# EAGLE design dnc (EAGLE 7.1.0)
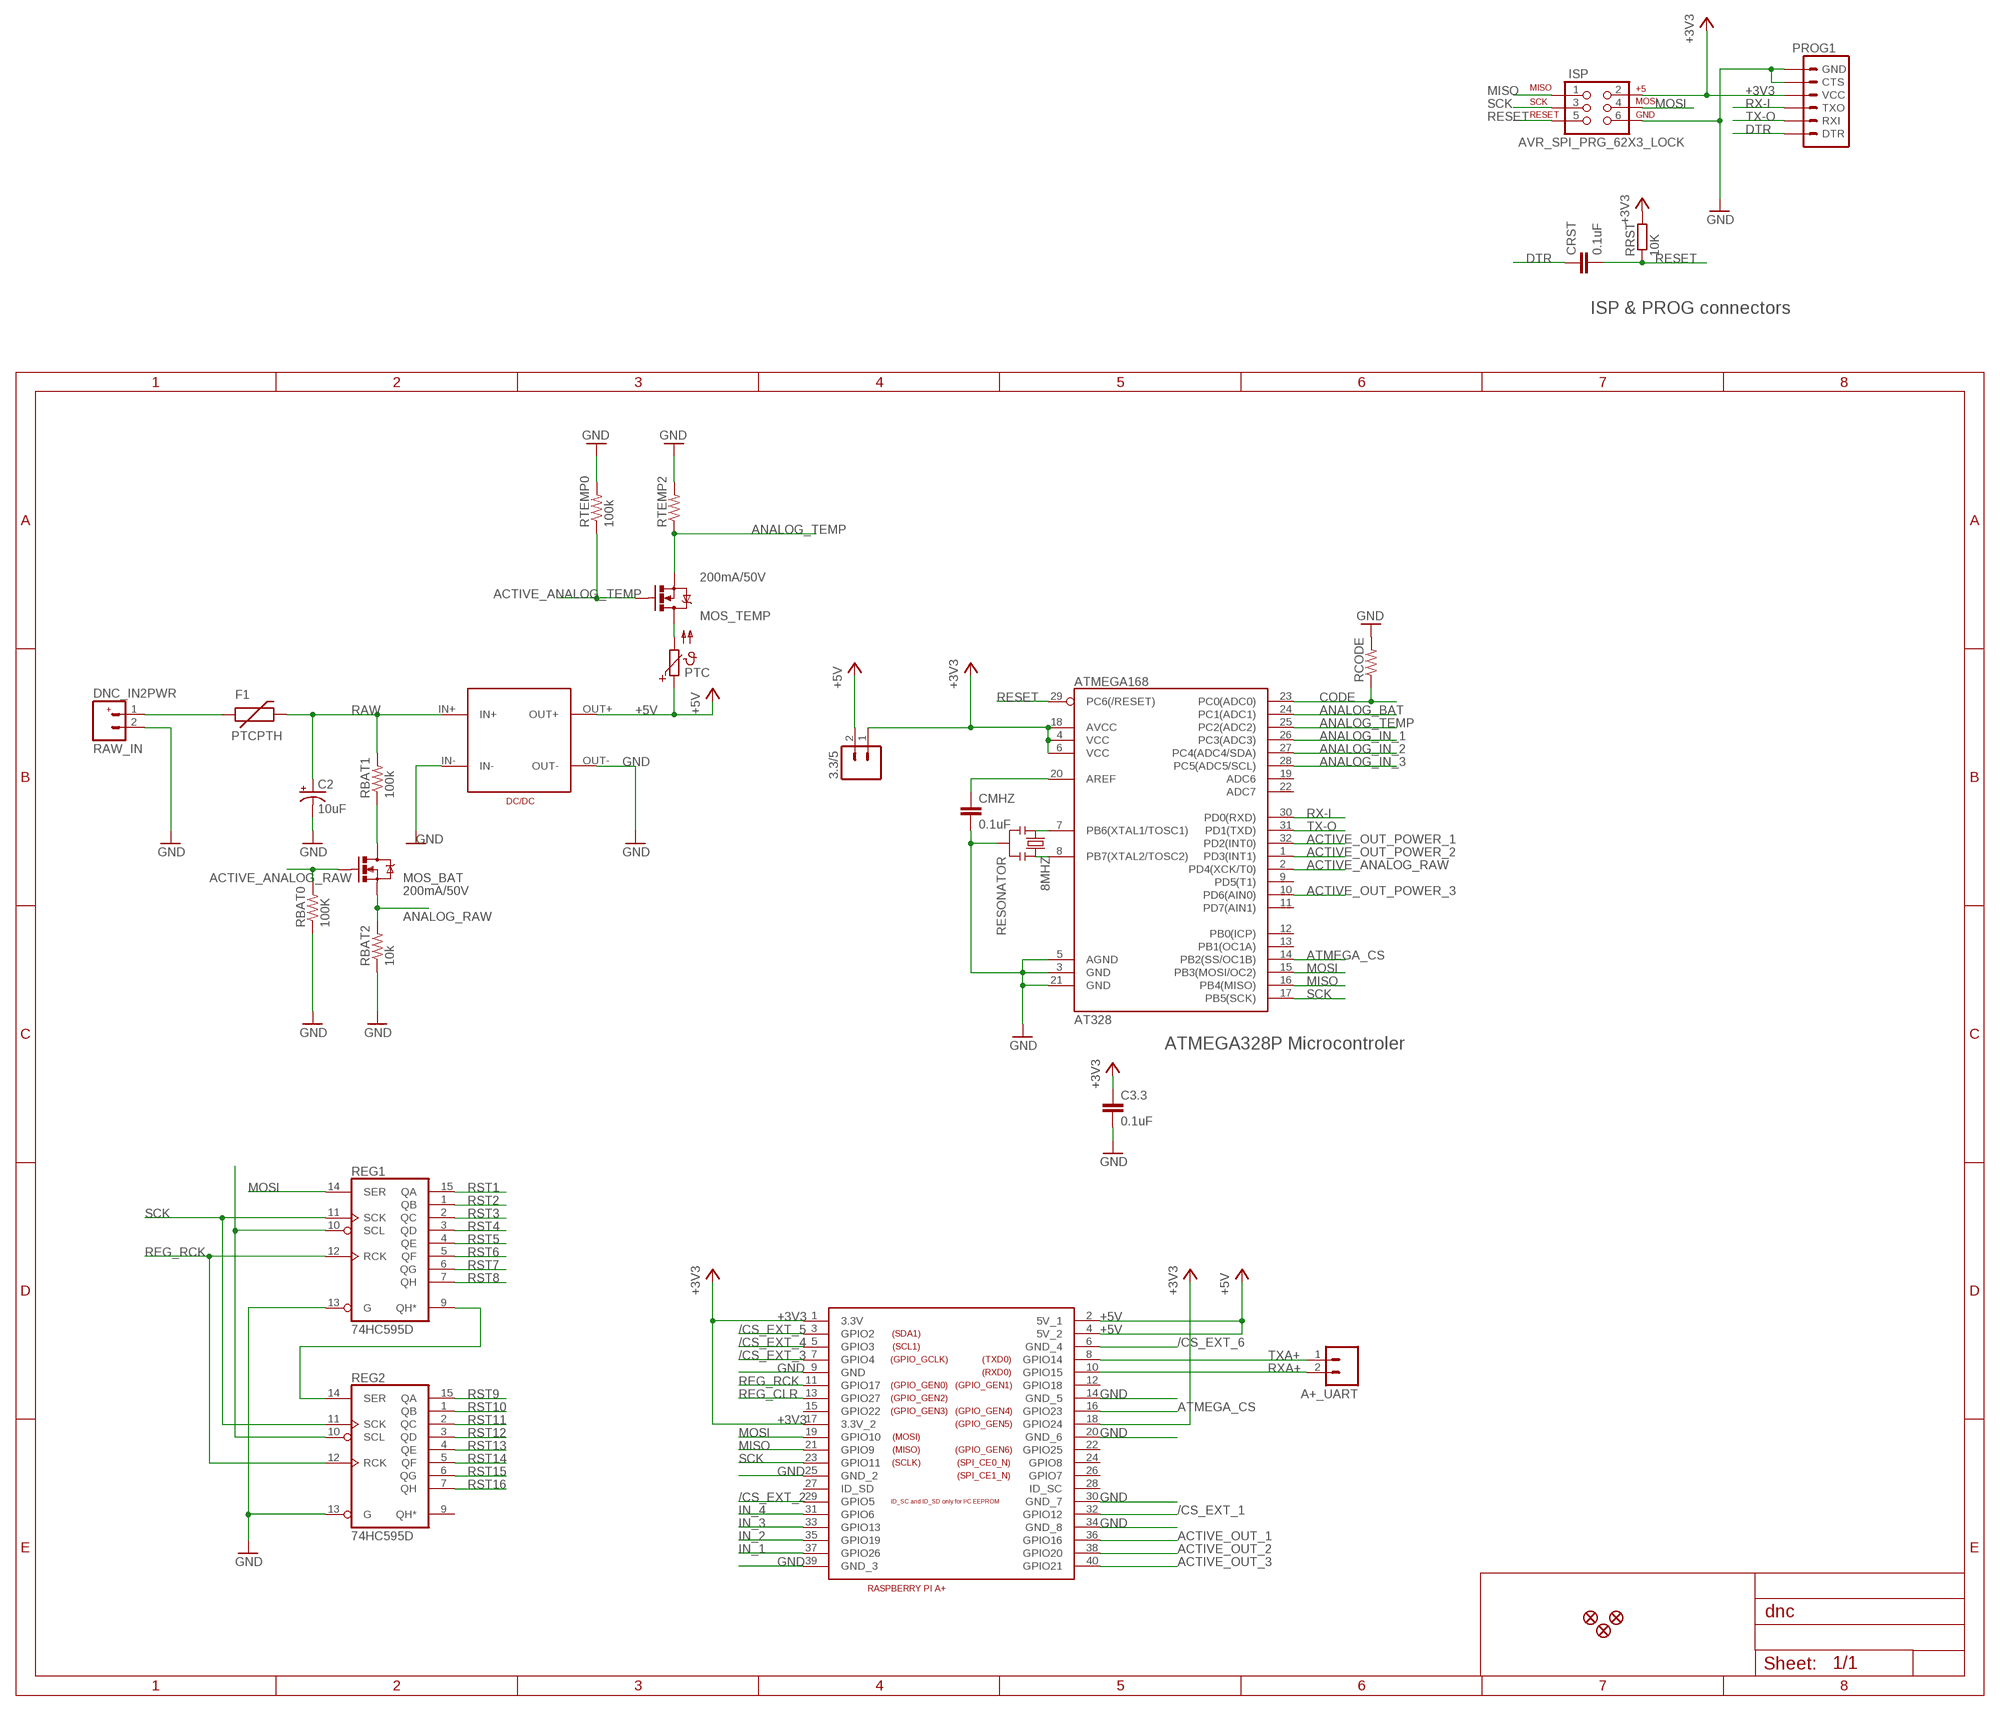
[diagram p0: schematic, sheet 1, part 1 of 2]
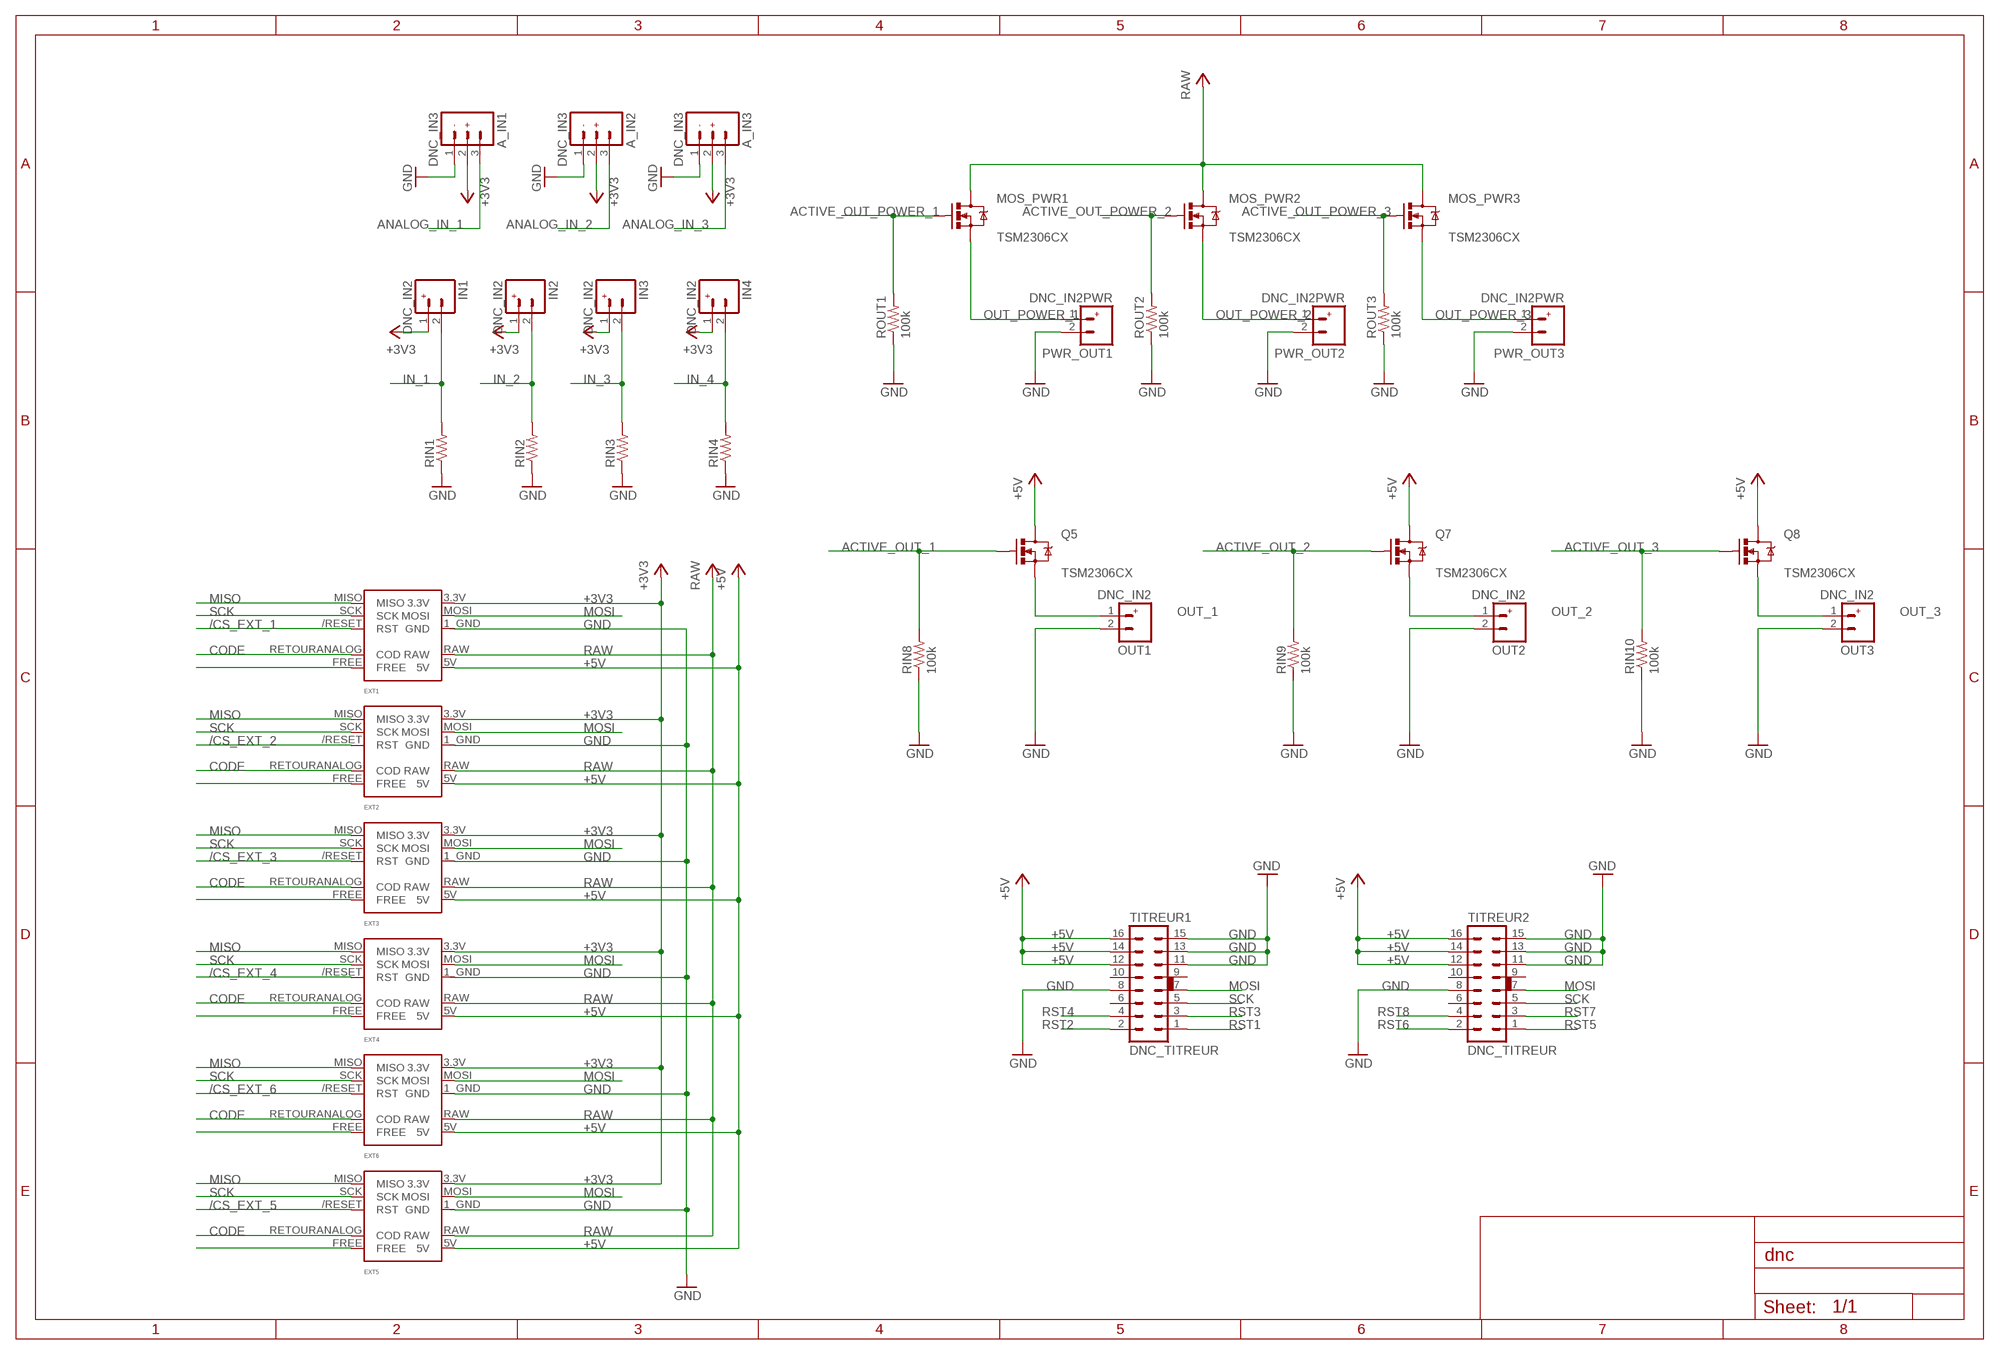
[diagram p1: schematic, sheet 1, part 2 of 2]

## Parts
3.3/5  M02PTH3  [1X02_LONGPADS]
8MHZ  RESONATOR  [RESONATOR_7MM]
A+_UART  M02LOCK_LONGPADS  [1X02_LOCK_LONGPADS]
A_IN1  DNC_IN3  [DNC_IN3]
A_IN2  DNC_IN3  [DNC_IN3]
A_IN3  DNC_IN3  [DNC_IN3]
AT328  ATMEGA168  [TQFP32-08]
C2  10uF  CAP_POL1206  [EIA3216]
C3.3  0.1uF  C-EUC0805  [C0805]
CMHZ  0.1uF  C-EUC0805  [C0805]
CRST  0.1uF  C-EUC0805  [C0805]
EXT1  EXT-DNC  [EXTPINDNC]
EXT2  EXT-DNC  [EXTPINDNC]
EXT3  EXT-DNC  [EXTPINDNC]
EXT4  EXT-DNC  [EXTPINDNC]
EXT5  EXT-DNC  [EXTPINDNC]
EXT6  EXT-DNC  [EXTPINDNC]
F1  PTCPTH  [PTC]
IN1  DNC_IN2  [DNC_IN2]
IN2  DNC_IN2  [DNC_IN2]
IN3  DNC_IN2  [DNC_IN2]
IN4  DNC_IN2  [DNC_IN2]
ISP  AVR_SPI_PRG_62X3_LOCK  [2X3_LOCK]
JP13  FIDUCIAL1X2.5  [FIDUCIAL-1X2.5]
JP14  FIDUCIAL1X2.5  [FIDUCIAL-1X2.5]
JP19  FIDUCIAL1X2.5  [FIDUCIAL-1X2.5]
MOS_BAT  200mA/50V  MOSFET-NCHANNELBSS138  [SOT23-3]
MOS_PWR1  TSM2306CX  MOSFET-NCHANNEL2N7002PW  [SOT323]
MOS_PWR2  TSM2306CX  MOSFET-NCHANNEL2N7002PW  [SOT323]
MOS_PWR3  TSM2306CX  MOSFET-NCHANNEL2N7002PW  [SOT323]
MOS_TEMP  200mA/50V  MOSFET-NCHANNELBSS138  [SOT23-3]
OUT1  DNC_IN2  [DNC_IN2]
OUT2  DNC_IN2  [DNC_IN2]
OUT3  DNC_IN2  [DNC_IN2]
PROG1  ARDUINO_SERIAL_PROGRAMLOCK  [1X06_LOCK]
PTC  PTC679  [P679]
PWR_OUT1  DNC_IN2PWR  [DNC_IN2_PWR]
PWR_OUT2  DNC_IN2PWR  [DNC_IN2_PWR]
PWR_OUT3  DNC_IN2PWR  [DNC_IN2_PWR]
Q5  TSM2306CX  MOSFET-NCHANNEL2N7002PW  [SOT323]
Q7  TSM2306CX  MOSFET-NCHANNEL2N7002PW  [SOT323]
Q8  TSM2306CX  MOSFET-NCHANNEL2N7002PW  [SOT323]
RAW_IN  DNC_IN2PWR  [DNC_IN2_PWR]
RBAT0  100K  RESISTOR0603-RES  [0603-RES]
RBAT1  100k  RESISTOR0603-RES  [0603-RES]
RBAT2  10k  RESISTOR0603-RES  [0603-RES]
RCODE  RESISTOR0603-RES  [0603-RES]
REG1  74HC595D  [SO16]
REG2  74HC595D  [SO16]
RIN1  RESISTOR0603-RES  [0603-RES]
RIN2  RESISTOR0603-RES  [0603-RES]
RIN3  RESISTOR0603-RES  [0603-RES]
RIN4  RESISTOR0603-RES  [0603-RES]
RIN8  100k  RESISTOR0603-RES  [0603-RES]
RIN9  100k  RESISTOR0603-RES  [0603-RES]
RIN10  100k  RESISTOR0603-RES  [0603-RES]
ROUT1  100k  RESISTOR0603-RES  [0603-RES]
ROUT2  100k  RESISTOR0603-RES  [0603-RES]
ROUT3  100k  RESISTOR0603-RES  [0603-RES]
RRST  10K  R-EU_R0603  [R0603]
RTEMP0  100k  RESISTOR0603-RES  [0603-RES]
RTEMP2  RESISTOR0603-RES  [0603-RES]
TITREUR1  DNC_TITREUR  [DNC_TITREUR]
TITREUR2  DNC_TITREUR  [DNC_TITREUR]
U$4  RASPIA+  [RASPIA+]
U$5  DC/DC_SEED  [DC/DC_SEED]

## Nets
+3V3: 3.3/5.1 A_IN1.2 A_IN2.2 A_IN3.2 AT328.4(VCC) AT328.6(VCC) AT328.18(AVCC) C3.3.1 EXT1.3.3V EXT2.3.3V EXT3.3.3V EXT4.3.3V EXT5.3.3V EXT6.3.3V IN1.1 IN2.1 IN3.1 IN4.1 ISP.2 PROG1.4(VCC) RRST.2 U$4.1(3.3V) U$4.17(3.3V_2) U$4.18(GPIO24)
+5V: 3.3/5.2 EXT1.5V EXT2.5V EXT3.5V EXT4.5V EXT5.5V EXT6.5V PTC.1 Q5.3(D) Q7.3(D) Q8.3(D) TITREUR1.12 TITREUR1.14 TITREUR1.16 TITREUR2.12 TITREUR2.14 TITREUR2.16 U$4.2(5V_1) U$4.4(5V_2) U$5.OUT+
/CS_EXT_1: EXT1./RESET(RST) U$4.32(GPIO12)
/CS_EXT_2: EXT2./RESET(RST) U$4.29(GPIO5)
/CS_EXT_3: EXT3./RESET(RST) U$4.7(GPIO4)
/CS_EXT_4: EXT4./RESET(RST) U$4.5(GPIO3)
/CS_EXT_5: EXT5./RESET(RST) U$4.3(GPIO2)
/CS_EXT_6: EXT6./RESET(RST) U$4.6(GND_4)
ACTIVE_ANALOG_RAW: AT328.2(PD4(XCK/T0)) MOS_BAT.1(G) RBAT0.2
ACTIVE_ANALOG_TEMP: MOS_TEMP.1(G) RTEMP0.1
ACTIVE_OUT_1: Q5.1(G) RIN8.2 U$4.36(GPIO16)
ACTIVE_OUT_2: Q7.1(G) RIN9.2 U$4.38(GPIO20)
ACTIVE_OUT_3: Q8.1(G) RIN10.2 U$4.40(GPIO21)
ACTIVE_OUT_POWER_1: AT328.32(PD2(INT0)) MOS_PWR1.1(G) ROUT1.2
ACTIVE_OUT_POWER_2: AT328.1(PD3(INT1)) MOS_PWR2.1(G) ROUT2.2
ACTIVE_OUT_POWER_3: AT328.10(PD6(AIN0)) MOS_PWR3.1(G) ROUT3.2
ANALOG_BAT: AT328.24(PC1(ADC1))
ANALOG_IN_1: A_IN1.3 AT328.26(PC3(ADC3))
ANALOG_IN_2: A_IN2.3 AT328.27(PC4(ADC4/SDA))
ANALOG_IN_3: A_IN3.3 AT328.28(PC5(ADC5/SCL))
ANALOG_RAW: MOS_BAT.2(S) RBAT2.2
ANALOG_TEMP: AT328.25(PC2(ADC2)) MOS_TEMP.2(S) RTEMP2.1
AREF: AT328.20(AREF) CMHZ.1
ATMEGA_CS: AT328.14(PB2(SS/OC1B)) U$4.16(GPIO23)
CODE: AT328.23(PC0(ADC0)) EXT1.RETOURANALOG(COD) EXT2.RETOURANALOG(COD) EXT3.RETOURANALOG(COD) EXT4.RETOURANALOG(COD) EXT5.RETOURANALOG(COD) EXT6.RETOURANALOG(COD) RCODE.1
DTR: CRST.1 PROG1.1(DTR)
GND: 8MHZ.2 A_IN1.1 A_IN2.1 A_IN3.1 AT328.3(GND) AT328.5(AGND) AT328.21(GND) C2.C(-) C3.3.2 CMHZ.2 EXT1.1_GND(GND) EXT2.1_GND(GND) EXT3.1_GND(GND) EXT4.1_GND(GND) EXT5.1_GND(GND) EXT6.1_GND(GND) ISP.6 OUT1.2 OUT2.2 OUT3.2 PROG1.5(CTS) PROG1.6(GND) PWR_OUT1.2 PWR_OUT2.2 PWR_OUT3.2 RAW_IN.2 RBAT0.1 RBAT2.1 RCODE.2 REG1.13(G) REG2.13(G) RIN1.1 RIN2.1 RIN3.1 RIN4.1 RIN8.1 RIN9.1 RIN10.1 ROUT1.1 ROUT2.1 ROUT3.1 RTEMP0.2 RTEMP2.2 TITREUR1.8 TITREUR1.11 TITREUR1.13 TITREUR1.15 TITREUR2.8 TITREUR2.11 TITREUR2.13 TITREUR2.15 U$4.9(GND) U$4.14(GND_5) U$4.20(GND_6) U$4.25(GND_2) U$4.30(GND_7) U$4.34(GND_8) U$4.39(GND_3) U$5.IN- U$5.OUT-
IN_1: IN1.2 RIN1.2 U$4.37(GPIO26)
IN_2: IN2.2 RIN2.2 U$4.35(GPIO19)
IN_3: IN3.2 RIN3.2 U$4.33(GPIO13)
IN_4: IN4.2 RIN4.2 U$4.31(GPIO6)
MISO: AT328.16(PB4(MISO)) EXT1.MISO EXT2.MISO EXT3.MISO EXT4.MISO EXT5.MISO EXT6.MISO ISP.1 U$4.21(GPIO9)
MOSI: AT328.15(PB3(MOSI/OC2)) EXT1.MOSI EXT2.MOSI EXT3.MOSI EXT4.MOSI EXT5.MOSI EXT6.MOSI ISP.4 REG1.14(SER) TITREUR1.7 TITREUR2.7 U$4.19(GPIO10)
N$3: MOS_BAT.3(D) RBAT1.1
N$4: EXT2.FREE
N$5: EXT3.FREE
N$7: REG1.9(QH*) REG2.14(SER)
N$8: EXT4.FREE
N$9: EXT6.FREE
N$10: EXT5.FREE
N$11: MOS_TEMP.3(D) PTC.2
N$12: F1.P$1 RAW_IN.1
N$21: EXT1.FREE
N$43: 8MHZ.1 AT328.7(PB6(XTAL1/TOSC1))
N$44: 8MHZ.3 AT328.8(PB7(XTAL2/TOSC2))
OUT_1: OUT1.1 Q5.2(S)
OUT_2: OUT2.1 Q7.2(S)
OUT_3: OUT3.1 Q8.2(S)
OUT_POWER_1: MOS_PWR1.2(S) PWR_OUT1.1
OUT_POWER_2: MOS_PWR2.2(S) PWR_OUT2.1
OUT_POWER_3: MOS_PWR3.2(S) PWR_OUT3.1
RAW: C2.A(+) EXT1.RAW EXT2.RAW EXT3.RAW EXT4.RAW EXT5.RAW EXT6.RAW F1.P$2 MOS_PWR1.3(D) MOS_PWR2.3(D) MOS_PWR3.3(D) RBAT1.2 U$5.IN+
REG_CLR: REG1.10(SCL) REG2.10(SCL) U$4.13(GPIO27)
REG_RCK: REG1.12(RCK) REG2.12(RCK) U$4.11(GPIO17)
RESET: AT328.29(PC6(/RESET)) CRST.2 ISP.5 RRST.1
RST1: REG1.15(QA) TITREUR1.1
RST2: REG1.1(QB) TITREUR1.2
RST3: REG1.2(QC) TITREUR1.3
RST4: REG1.3(QD) TITREUR1.4
RST5: REG1.4(QE) TITREUR2.1
RST6: REG1.5(QF) TITREUR2.2
RST7: REG1.6(QG) TITREUR2.3
RST8: REG1.7(QH) TITREUR2.4
RST9: REG2.15(QA)
RST10: REG2.1(QB)
RST11: REG2.2(QC)
RST12: REG2.3(QD)
RST13: REG2.4(QE)
RST14: REG2.5(QF)
RST15: REG2.6(QG)
RST16: REG2.7(QH)
RX-I: AT328.30(PD0(RXD)) PROG1.3(TXO)
RXA+: A+_UART.2 U$4.10(GPIO15)
SCK: AT328.17(PB5(SCK)) EXT1.SCK EXT2.SCK EXT3.SCK EXT4.SCK EXT5.SCK EXT6.SCK ISP.3 REG1.11(SCK) REG2.11(SCK) TITREUR1.5 TITREUR2.5 U$4.23(GPIO11)
TX-O: AT328.31(PD1(TXD)) PROG1.2(RXI)
TXA+: A+_UART.1 U$4.8(GPIO14)
Unconnected: AT328.9(PD5(T1)) AT328.11(PD7(AIN1)) AT328.12(PB0(ICP)) AT328.13(PB1(OC1A)) AT328.19(ADC6) AT328.22(ADC7) REG2.9(QH*) TITREUR1.6 TITREUR1.9 TITREUR1.10 TITREUR2.6 TITREUR2.9 TITREUR2.10 U$4.12(GPIO18) U$4.15(GPIO22) U$4.22(GPIO25) U$4.24(GPIO8) U$4.26(GPIO7) U$4.27(ID_SD) U$4.28(ID_SC)

## Notes on the sheet
- ISP & PROG connectors
- ATMEGA328P Microcontroler

## Power pins joined to a net without a drawn wire
GND: REG1.8(GND) REG2.8(GND)
VCC: REG1.16(VCC) REG2.16(VCC)

## Library data of the parts
3.3/5 A+_UART = SparkFun:M02: Header 2 Standard 2-pin 0.1" header. Use with straight break away headers (SKU : PRT-00116), right angle break away headers (PRT-00553), swiss pins (PRT-00743), machine pins (PRT-00117), and female headers (PRT-00115). Molex polarized connector foot print use with SKU : PRT-08233 with associated crimp pins and housings.
8MHZ = pierre_vv:RESONATOR
A_IN1-A_IN3 = pierre_vv:DNC_IN3
AT328 = SparkFun:ATMEGA168
C2 = SparkFun:CAP_POL: Capacitor Polarized These are standard SMD and PTH capacitors. Normally 10uF, 47uF, and 100uF in electrolytic and tantalum varieties. Always verify the external diameter of the through hole cap, it varies with capacity, voltage, and manufacturer. The EIA devices should be standard.
C3.3 CMHZ CRST = rcl:C-EU: CAPACITOR, European symbol
EXT1-EXT6 = pierre_vv:EXT-DNC
F1 = SparkFun-PowerIC:PTC: Resettable Fuse PTC Resettable Fuse. Spark Fun Electronics SKU : COM-08357
IN1-IN4 OUT1-OUT3 PWR_OUT1-PWR_OUT3 RAW_IN = pierre_vv:DNC_IN2
ISP = SparkFun:AVR_SPI_PRG_6: AVR ISP 6 Pin This is the reduced ISP connector for AVR programming. Common on Arduino. This footprint will take up less PCB space and can be used with a 10-pin to 6-pin adapter such as SKU: BOB-08508
JP13 JP14 JP19 = SparkFun:FIDUCIAL: Fiducial Alignment Points Various fiducial points for machine vision alignment.
MOS_BAT MOS_TEMP = SparkFun-DiscreteSemi:MOSFET-NCHANNEL: Common NMOSFET Parts MFG P/N Store ID Prod ID FDD8780 TRANS-09984 SI7820DN TRANS-11055 FDS6630A IC-08089 2N7002PW TRANS-11151 FQP30N06L COM-10213 TRANS-10060 BSS123LT1G TRANS-08345 BSS138 TRANS-00830 BS170 2N7000; PROD_ID: TRANS-00830
MOS_PWR1-MOS_PWR3 Q5 Q7 Q8 = SparkFun-DiscreteSemi:MOSFET-NCHANNEL: Common NMOSFET Parts MFG P/N Store ID Prod ID FDD8780 TRANS-09984 SI7820DN TRANS-11055 FDS6630A IC-08089 2N7002PW TRANS-11151 FQP30N06L COM-10213 TRANS-10060 BSS123LT1G TRANS-08345 BSS138 TRANS-00830 BS170 2N7000; PROD_ID: TRANS-11151
PROG1 = SparkFun:ARDUINO_SERIAL_PROGRAM
PTC = ptc-ntc:PTC679: PHILIPS PTC; OC_FARNELL: unknown; OC_NEWARK: unknown
RBAT0 RBAT1 RBAT2 RCODE RIN1-RIN4 RIN8-RIN10 ROUT1-ROUT3 RTEMP0 RTEMP2 = SparkFun-Passives:RESISTOR: Resistor Basic schematic elements and footprints for 0603, 1206, and PTH resistors.
REG1 REG2 = 74xx-eu:74*595: 8-bit SHIFT REGISTER, output latch
RRST = rcl:R-EU_: RESISTOR, European symbol
TITREUR1 TITREUR2 = pierre_vv:DNC_TITREUR
U$4 = pierre_vv:RASPIA+
U$5 = pierre_vv:DC/DC_SEED

## Net classes
0 default: width 0.203 mm
1 GND: width 0.254 mm
2 3.3V: width 0.254 mm

## Board
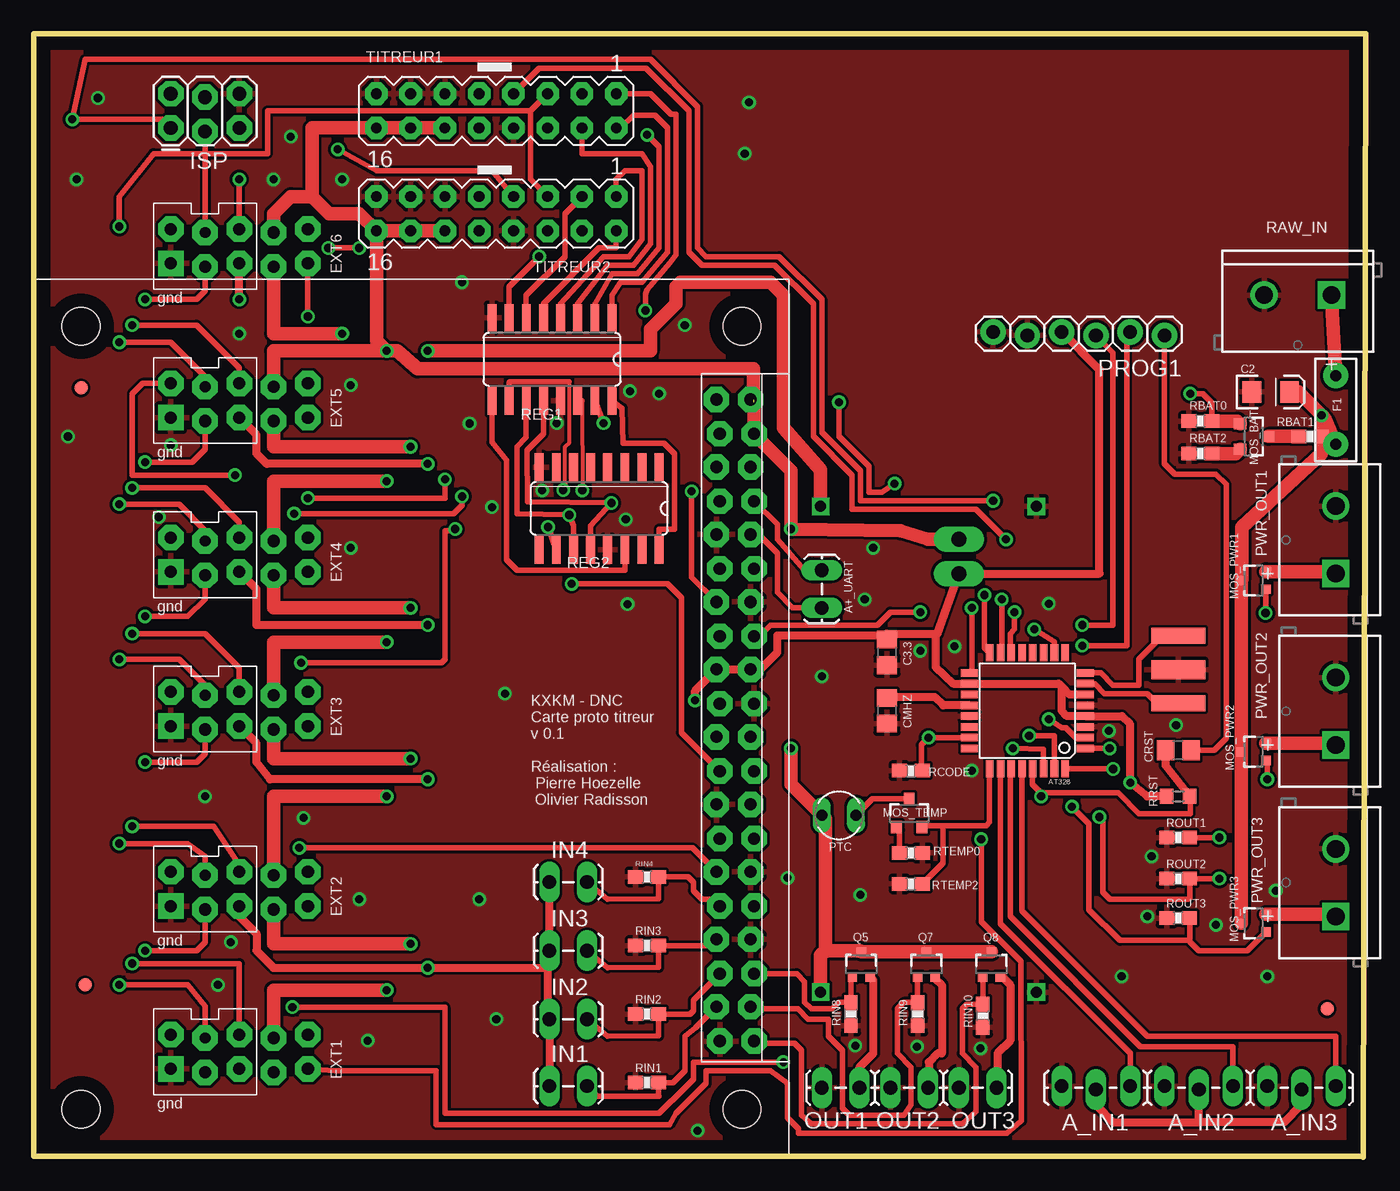
[diagram p2: board, top side]
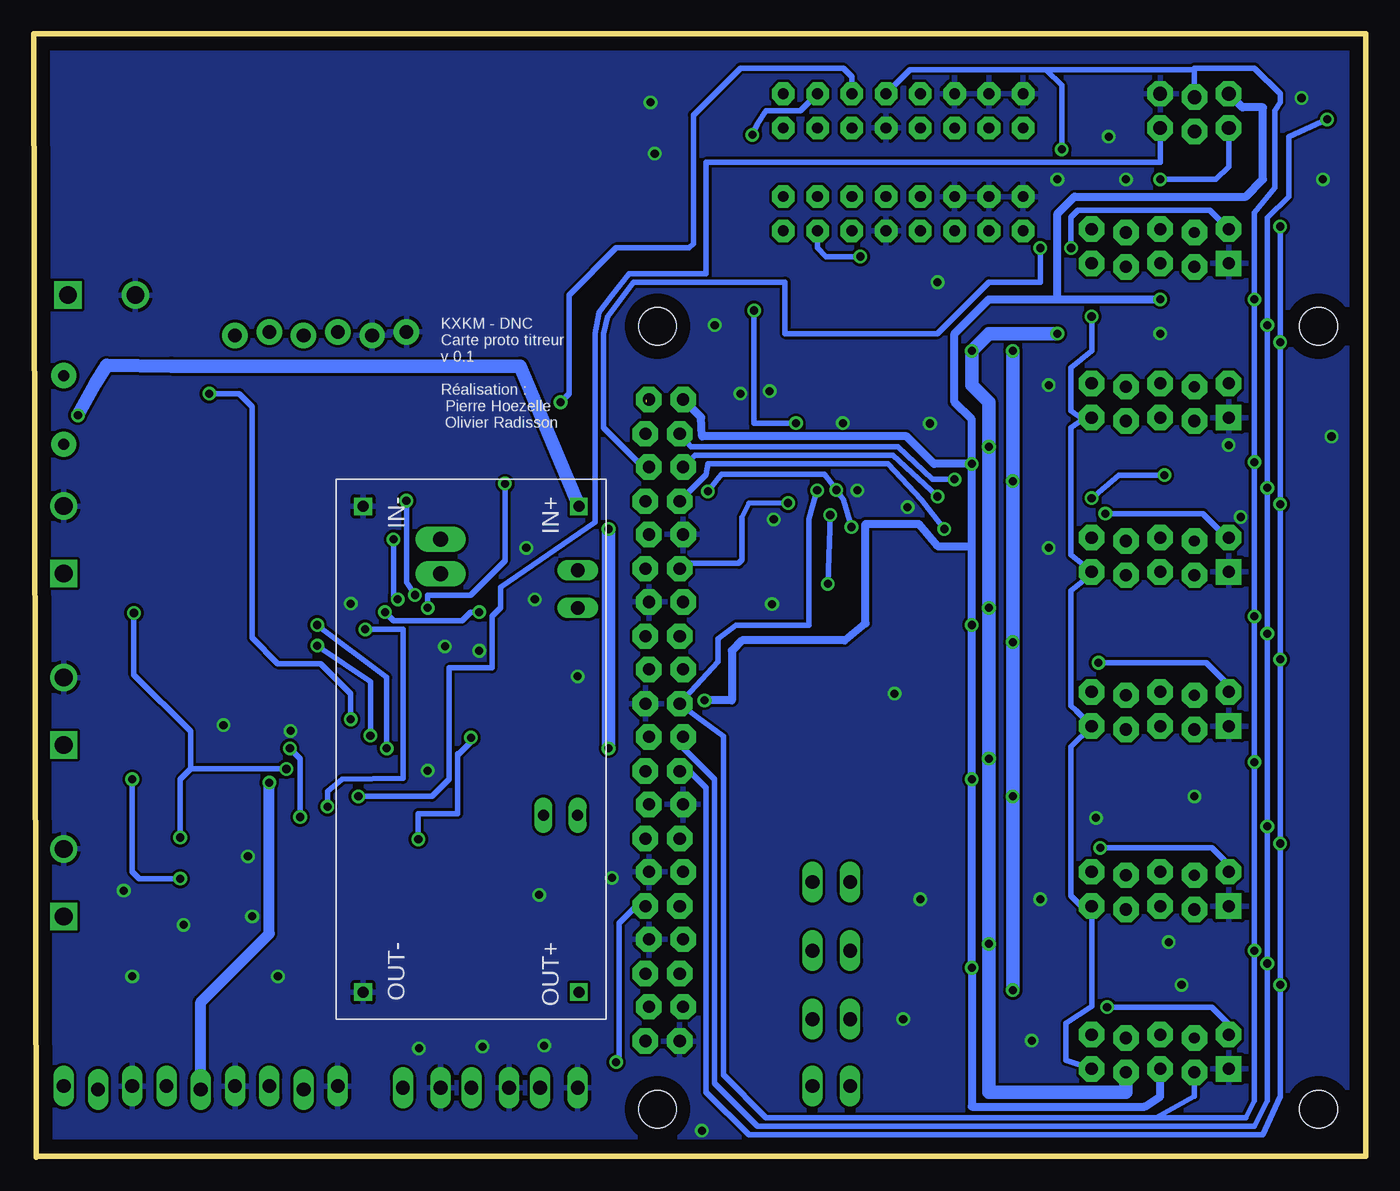
[diagram p3: board, bottom side, seen from below]

Size 98.74 x 83.25 mm. Coordinates in mm from the lower left corner, seen from the top.
Outline: 98.41,0.06 0,0.06 0,83.25 98.74,83.25 98.55,0
Copper layers (1*16): Top 0.035mm / dielectric 1.5mm / Bottom 0.035mm
Design rules "default": minimum track width 10mil, minimum drill 24mil, track to track 8mil, track to pad 8mil, pad to pad 8mil, via to via 8mil, smd to smd 8mil, copper to edge 40mil, drill to drill 8mil, minimum pad ring 10mil, minimum via ring 8mil, stop-mask expansion 4mil, vias tented up to drill 0mil, thermal gap 10mil

### Footprints (pad centres in the part's own frame; a part is rotated, then mirrored left to right if it is on the bottom)
1X02_LONGPADS = drill 1.118 pad 1.88 long: 1 0,0; 2 2.54,0
RESONATOR_7MM = smd 1.2 x 4: 1 -2.5,0; 3 2.5,0 | smd 1.4 x 4: 2 0,0
1X02_LOCK_LONGPADS = drill 1.016 long: 1 -0.127,0; 2 2.667,0
DNC_IN3 = drill 1.016 long: 1 0,0; 2 2.54,-0.254; 3 5.08,0
TQFP32-08 = smd 1.27 x 0.559: 1 -4.293,2.8; 2 -4.293,2; 3 -4.293,1.2; 4 -4.293,0.4; 5 -4.293,-0.4; 6 -4.293,-1.2; 7 -4.293,-2; 8 -4.293,-2.8; 17 4.293,-2.8; 18 4.293,-2; 19 4.293,-1.2; 20 4.293,-0.4; 21 4.293,0.4; 22 4.293,1.2; 23 4.293,2; 24 4.293,2.8 | smd 0.559 x 1.27: 9 -2.8,-4.293; 10 -2,-4.293; 11 -1.2,-4.293; 12 -0.4,-4.293; 13 0.4,-4.293; 14 1.2,-4.293; 15 2,-4.293; 16 2.8,-4.293; 25 2.8,4.293; 26 2,4.293; 27 1.2,4.293; 28 0.4,4.293; 29 -0.4,4.293; 30 -1.2,4.293; 31 -2,4.293; 32 -2.8,4.293
EIA3216 = smd 1.4 x 1.6: A 1.4,0; C -1.4,0
C0805 = smd 1.3 x 1.5: 1 -0.95,0; 2 0.95,0
EXTPINDNC = drill 0.9 pad 1.88 square: 1_GND -1.143,5.08 | drill 0.9 pad 1.88 octagon: 3.3V -1.143,0; 5V 1.143,-2.54; /RESET 1.397,5.08; FREE 1.397,-5.08; MISO 1.397,0; MOSI -1.397,2.54; RAW -1.397,-2.54; RETOURANALOG -1.143,-5.08 | drill 0.8 pad 1.88 octagon: SCK 1.143,2.54
PTC = drill 0.8 pad 1.88: P$1 -2.54,0; P$2 2.54,0
DNC_IN2 = drill 1.016 long: 1 -0.127,0; 2 2.667,0
2X3_LOCK = drill 1.016 pad 1.88 octagon: 1 0,0; 2 0,2.54; 3 2.54,-0.254; 4 2.54,2.286; 5 5.08,0; 6 5.08,2.54
FIDUCIAL-1X2.5 = smd 1 x 1: 1 0,0
SOT23-3 = smd 0.8 x 0.9: 1 -0.95,-1; 2 0.95,-1; 3 0,1.1
SOT323 = smd 0.7 x 0.7: 1 -0.65,-0.925; 2 0.65,-0.925; 3 0,0.925
1X06_LOCK = drill 1.016 pad 1.88: 1 0,0; 2 2.54,-0.254; 3 5.08,0; 4 7.62,-0.254; 5 10.16,0; 6 12.7,-0.254
P679 = drill 0.813 long: 1 -1.27,0; 2 1.27,0
DNC_IN2_PWR = drill 1.3 pad 2.032 square: 1 0,0 | drill 1.3 pad 2.032: 2 5,0
0603-RES = smd 1.1 x 1: 1 -0.85,0; 2 0.85,0
SO16 = smd 0.66 x 2.032: 1 -4.445,-3.073; 2 -3.175,-3.073; 3 -1.905,-3.073; 4 -0.635,-3.073; 5 0.635,-3.073; 6 1.905,-3.073; 7 3.175,-3.073; 8 4.445,-3.073; 9 4.445,3.073; 10 3.175,3.073; 11 1.905,3.073; 12 0.635,3.073; 13 -0.635,3.073; 14 -1.905,3.073; 15 -3.175,3.073; 16 -4.445,3.073
R0603 = smd 1 x 1.1: 1 -0.85,0; 2 0.85,0
DNC_TITREUR = drill 0.8 pad 1.676 octagon: 1 -8.89,-1.27; 2 -8.89,1.27; 3 -6.35,-1.27; 4 -6.35,1.27; 5 -3.81,-1.27; 6 -3.81,1.27; 7 -1.27,-1.27; 8 -1.27,1.27; 9 1.27,-1.27; 10 1.27,1.27; 11 3.81,-1.27; 12 3.81,1.27; 13 6.35,-1.27; 14 6.35,1.27; 15 8.89,-1.27; 16 8.89,1.27
RASPIA+ = drill 0.9 pad 1.88 octagon: 1 -50.603,-56.08; 2 -53.143,-56.08; 3 -50.857,-53.54; 4 -53.397,-53.54; 5 -50.603,-51.08; 6 -53.143,-51.08; 7 -50.857,-48.54; 8 -53.397,-48.54; 9 -50.603,-46.08; 10 -53.143,-46.08; 11 -50.857,-43.54; 12 -53.397,-43.54; 13 -50.603,-41.08; 14 -53.143,-41.08; 15 -50.857,-38.54; 16 -53.397,-38.54; 17 -50.603,-36.08; 18 -53.143,-36.08; 19 -50.857,-33.54; 20 -53.397,-33.54; 21 -50.603,-31.08; 22 -53.143,-31.08; 23 -50.857,-28.54; 24 -53.397,-28.54; 25 -50.603,-26.08; 26 -53.143,-26.08; 27 -50.857,-23.54; 28 -53.397,-23.54; 29 -50.603,-21.08; 30 -53.143,-21.08; 31 -50.857,-18.54; 32 -53.397,-18.54; 33 -50.603,-16.08; 34 -53.143,-16.08; 35 -50.857,-13.54; 36 -53.397,-13.54; 37 -50.603,-11.08; 38 -53.143,-11.08; 39 -50.857,-8.54; 40 -53.397,-8.54 | hole 2.8: -52.5,-3.5; -3.5,-3.5; -3.5,-61.5; -52.5,-61.5
DC/DC_SEED = drill 0.8 square: IN+ -2,18; IN- -2,2; OUT+ -38,18; OUT- -38,2

### Placement (x,y rotation side)
3.3/5  68.58,43.24 90 top
8MHZ  84.84,36.13 90 top
A+_UART  58.42,43.37 270 top
A_IN1  76.2,5.27 0 top
A_IN2  83.82,5.27 0 top
A_IN3  91.44,5.27 0 top
AT328  73.66,33.08 180 top
C2  91.69,56.71 0 top
C3.3  63.25,37.4 270 top
CMHZ  63.25,33.08 270 top
CRST  84.84,30.16 180 top
EXT1  15.24,7.68 90 top
EXT2  15.24,19.75 90 top
EXT3  15.24,33.08 90 top
EXT4  15.24,44.51 90 top
EXT5  15.24,55.94 90 top
EXT6  15.24,67.37 90 top
F1  96.52,55.37 270 top
IN1  38.35,5.27 0 top
IN2  38.35,10.22 0 top
IN3  38.35,15.3 0 top
IN4  38.35,20.38 0 top
ISP  10.16,76.26 0 top
JP13  3.81,12.76 0 top
JP14  95.89,10.99 0 top
JP19  3.51,57 0 top
MOS_BAT  90.42,53.4 270 top
MOS_PWR1  90.42,42.74 90 top
MOS_PWR2  90.42,30.04 90 top
MOS_PWR3  90.42,17.34 90 top
MOS_TEMP  64.9,25.46 0 top
OUT1  61.09,5.14 180 top
OUT2  66.17,5.14 180 top
OUT3  71.25,5.14 180 top
PROG1  83.82,60.9 180 top
PTC  59.69,25.34 0 top
PWR_OUT1  96.52,43.24 90 top
PWR_OUT2  96.52,30.54 90 top
PWR_OUT3  96.52,17.84 90 top
Q5  61.34,14.29 0 top
Q7  66.17,14.29 0 top
Q8  70.99,14.29 0 top
RAW_IN  96.2,63.88 180 top
RBAT0  86.49,54.55 0 top
RBAT1  94.61,53.4 0 top
RBAT2  86.49,52.13 0 top
RCODE  65.02,28.64 180 top
REG1  38.42,59.12 180 top
REG2  41.91,48.07 180 top
RIN1  45.47,5.52 0 top
RIN2  45.47,10.6 0 top
RIN3  45.47,15.68 0 top
RIN4  45.47,20.76 0 top
RIN8  60.58,10.6 90 top
RIN9  65.53,10.6 90 top
RIN10  70.36,10.48 90 top
ROUT1  84.84,23.69 0 top
ROUT2  84.84,20.64 0 top
ROUT3  84.84,17.72 0 top
RRST  84.84,26.73 180 top
RTEMP0  65.02,22.54 0 top
RTEMP2  65.02,20.26 180 top
TITREUR1  34.29,77.53 180 top
TITREUR2  34.29,69.91 180 top
U$4  0,0.06 180 top
U$5  76.33,50.23 90 top

### Tracks (layer width: path | path; a pad name or v marks a point on that pad's centre or on a via)
+3V3  (via drill 0.6)
  Top 0.61: 76.2,34.86 76.78,34.28 AT328.6 | 76.2,34.86 76.2,33.08 76.6,32.68 AT328.4 80.66,32.68 81.28,32.07 v81.28,27.75 82.55,26.73 RRST.2 | 76.2,34.86 75.98,35.08 AT328.18 69.44,35.09 68.17,35.09 66.85,36.34 66.85,38.8 | A_IN1.2 78.74,3.87 80.01,2.6 86.36,2.6 | A_IN3.2 93.98,3.87 92.71,2.6 86.36,2.6 | 86.36,2.6 A_IN2.2 | v29.21,28 17.53,28 16.51,29.27 16.51,30.67 EXT3.3.3V | v29.21,39.43 16.51,39.43 16.51,42.1 EXT4.3.3V | v29.21,51.37 17.27,51.37 16.51,52.13 16.51,53.53 EXT5.3.3V | EXT2.3.3V 15.24,17.84 16.51,16.57 16.51,15.3 17.78,14.03 v29.21,14.03 38.1,14.03 | v15.24,63.56 EXT6.3.3V | 38.1,14.03 38.1,15.18 IN3.1 IN4.1 | 38.1,14.03 38.1,10.35 IN2.1 IN1.1 | PROG1.4 78.99,58.36 78.99,43.24 3.3/5.1 66.99,38.8 66.85,38.8 | 66.85,38.8 63.25,38.8 C3.3.1 62.93,38.67 55.12,38.67 55.12,37.4 53.86,36.14 U$4.18 U$4.17 | U$4.17 50.03,36.14 | v49.02,33.85 49.02,34.56 U$4.17
  Bottom 0.61: 29.21,45.28 v29.21,39.43 v29.21,28 v29.21,14.03 29.21,3.75 16.38,3.75 15.24,4.51 EXT1.3.3V | 29.21,45.28 v29.21,51.37 | v29.21,51.37 29.21,54.67 30.48,55.94 30.48,61.02 27.94,63.56 22.86,63.56 | 22.86,63.56 v15.24,63.56 | 22.86,63.56 22.86,69.91 21.59,71.18 8.89,71.18 7.62,72.45 7.62,77.79 9.14,77.79 ISP.2 | v29.21,51.37 32,51.37 34.04,53.4 49.2,53.4 49.28,54.82 U$4.1 | 29.21,45.28 31.75,45.28 33.15,46.93 37.08,46.93 37.08,39.56 38.61,38.29 46.23,38.29 46.99,37.53 46.99,33.85 v49.02,33.85
  Bottom 0.813: A_IN2.2 86.36,11.49 81.28,16.57 v81.28,27.75
+5V  (via drill 0.6)  (1 unrouted)
  Top 1.016: U$5.OUT+ 58.33,14.96 58.67,15.3 | 58.67,15.3 61.25,15.3 Q5.3 Q7.3 Q8.3 | 53.34,55.94 53.4,55.89 U$4.4 56.13,50.87 v56.13,46.55 64.26,46.42 66.29,45.78 3.3/5.2 | U$4.2 53.34,56.14 53.34,58.42 28.45,58.42 26.92,59.75 v26.16,59.75 | v26.16,59.75 17.78,59.75 EXT5.5V | v26.16,12.38 17.78,12.38 EXT1.5V | EXT2.5V 17.78,26.73 v26.16,26.73 | EXT4.5V 17.78,50.1 v26.16,50.1 | v26.16,59.75 25.4,60.52 TITREUR2.16 | 20.64,71.18 21.91,69.91 24.13,69.91 TITREUR2.16 | 20.64,71.18 20.64,76.26 TITREUR1.16 TITREUR1.14 TITREUR1.12 | EXT6.5V 17.78,69.91 19.05,71.18 20.64,71.18 | EXT3.5V 17.78,38.16 v26.16,38.16 | TITREUR2.16 TITREUR2.14 TITREUR2.12 | v56.13,30.29 56.13,27.62 PTC.1 58.67,25.08 58.67,15.3
  Bottom 1.016: v26.16,59.75 v26.16,50.1 v26.16,38.16 v26.16,26.73 v26.16,12.38 | v56.13,46.55 v56.13,30.29
/CS_EXT_1  (via drill 0.6)
  Top 0.406: v19.18,11.11 30.48,11.11 30.48,3.24 46.35,3.24 48.26,5.14 48.9,5.78 48.9,7.05 v55.56,7.05
  Bottom 0.406: EXT1./RESET 10.16,9.84 11.43,11.11 v19.18,11.11 | v55.56,7.05 55.37,7.18 55.37,17.34 54.1,18.6 U$4.32
/CS_EXT_2  (via drill 0.6)
  Top 0.406: v19.68,22.92 48.82,22.92 U$4.29
  Bottom 0.406: EXT2./RESET 10.16,21.65 11.43,22.92 v19.68,22.92
/CS_EXT_3  (via drill 0.6)
  Top 0.406: v19.81,36.64 30.23,36.64 30.48,36.89 30.48,46.42 31.11,46.42 v31.24,46.55
  Bottom 0.406: EXT3./RESET 10.16,34.99 11.81,36.64 v19.81,36.64 | v31.24,46.55 32.96,48.7 35.43,51.37 48.77,51.37 48.9,50.57 U$4.7
/CS_EXT_4  (via drill 0.6)
  Top 0.406: v19.3,47.69 31.11,47.69 31.75,48.32 v31.75,48.96
  Bottom 0.406: EXT4./RESET 10.29,45.91 12.06,47.69 v19.3,47.69 | v31.75,48.96 35.05,52.01 49.74,52.01 U$4.5
/CS_EXT_5  (via drill 0.6)
  Top 0.406: v20.32,48.83 30.48,48.83 v30.48,50.23 | EXT5./RESET 8.06,57.34 7.3,56.58 7.3,50.55 v14.92,50.55
  Bottom 0.406: v30.48,50.23 32.13,50.23 34.67,52.64 50.02,52.64 U$4.3 | v14.92,50.55 18.29,50.55 v20.32,48.83
/CS_EXT_6  (via drill 0.6)
  Top 0.406: v24.13,67.37 v21.84,67.37
  Bottom 0.406: U$4.6 53.62,51.14 56.52,54.04 56.52,61.02 56.2,62.29 54.29,64.83 43.05,64.83 43.05,61.02 31.75,61.02 27.94,64.83 24.13,64.83 v24.13,67.37 | v21.84,67.37 21.84,69.66 21.34,70.17 11.56,70.17 EXT6./RESET
ACTIVE_ANALOG_RAW  (via drill 0.6 pad 0.41)
  Top 0.406: AT328.2 77.25,31.08 76.52,31.81 76.2,31.81 v75.25,32.45 | RBAT0.2 87.34,55.92 86.68,56.58 v85.72,56.58
  Top 1.016: RBAT0.2 89.23,54.55 MOS_BAT.1
  Bottom 0.406: v85.72,56.58 83.5,56.58 82.55,55.63 82.55,38.48 80.64,36.58 77.47,36.58 75.25,34.35 v75.25,32.45
ACTIVE_ANALOG_TEMP
  Top 0.406: RTEMP0.1 64.17,24.24 MOS_TEMP.1
ACTIVE_OUT_1
  Top 0.406: Q5.1 60.58,13.25 RIN8.2 60.54,11.49 59.69,11.49 59.18,10.99 57.66,10.99 57.15,11.49 57.15,13.02 56.56,13.6 U$4.36
ACTIVE_OUT_2
  Top 0.406: Q7.1 65.52,11.47 | 65.52,11.47 RIN9.2 | 65.52,11.47 64.49,11.47 64.01,10.99 64.01,7.68 65.02,6.67 65.02,3.87 64.52,3.11 60.45,3.11 59.94,3.62 59.94,7.94 58.93,8.95 58.93,10.22 57.4,10.22 56.64,10.99 53.3,10.99 U$4.38
ACTIVE_OUT_3
  Top 0.406: Q8.1 70.36,13.35 RIN10.2 69.18,11.33 68.83,10.99 68.83,7.68 69.85,6.67 69.85,3.37 68.83,2.48 57.66,2.48 56.9,3.11 56.9,7.94 56.39,8.45 53.55,8.45 U$4.40
ACTIVE_OUT_POWER_1  (via drill 0.6)
  Top 0.406: AT328.32 78.72,28.79 v80.01,28.77 | v87.88,23.69 ROUT1.2 | v91.31,40.32 91.31,42.05 MOS_PWR1.1
  Bottom 0.406: v80.01,28.77 87.12,28.77 | 87.12,28.77 87.88,28 v87.88,23.69 | 87.12,28.77 87.12,31.56 91.31,35.75 v91.31,40.32
ACTIVE_OUT_POWER_2  (via drill 0.6)
  Top 0.406: v87.88,20.64 ROUT2.2 85.69,19.2 85.6,19.11 79.76,19.11 79.25,19.62 79.25,24.96 v78.99,25.21 | v91.44,28 91.44,29.29 MOS_PWR2.1 | v79.76,30.29 AT328.1
  Bottom 0.406: v87.88,20.64 90.93,20.64 91.44,21.15 v91.44,28 | v78.99,25.21 78.99,29.53 v79.76,30.29
ACTIVE_OUT_POWER_3  (via drill 0.6)
  Top 0.406: MOS_PWR3.1 89.97,15.3 86.36,15.3 85.69,15.98 ROUT3.2 85.69,16.15 85.6,16.07 80.52,16.07 78.23,18.35 78.23,24.7 v76.96,25.97 | AT328.10 75.66,38.2 v74.17,39.12
  Bottom 0.406: v74.17,39.12 71.37,39.12 71.37,28.07 75.88,28 76.96,27.11 v76.96,25.97
ANALOG_IN_1
  Top 0.406: AT328.26 71.66,17.3 81.28,7.68 A_IN1.3
ANALOG_IN_2
  Top 0.406: A_IN2.3 88.9,8.19 82.04,8.19 72.39,17.84 72.39,28.72 AT328.27
ANALOG_IN_3
  Top 0.406: AT328.28 73.26,18.24 82.55,8.95 96.52,8.95 A_IN3.3
ANALOG_RAW
  Top 1.016: RBAT2.2 89.1,52.13 MOS_BAT.2
ANALOG_TEMP
  Top 0.406: 65.85,24.39 MOS_TEMP.2 65.96,24.57 67.39,24.57 | AT328.25 70.86,24.82 70.61,24.57 67.39,24.57 | 67.39,24.57 67.39,21.77 RTEMP2.1
AREF
  Top 0.61: AT328.20 67.42,33.48 66.8,34.1 63.31,34.1 CMHZ.1
ATMEGA_CS  (via drill 0.6 pad 0.41)
  Top 0.406: U$4.16 53.78,38.6 54.61,39.43 62.55,39.43 63.5,40.39 v65.72,40.39 | v72.71,40.39 72.71,39.12 72.39,38.8 72.39,37.45 AT328.14
  Bottom 0.406: v65.72,40.39 66.36,40.39 66.99,39.75 72.07,39.75 v72.71,40.39
CODE  (via drill 0.6)
  Top 0.406: v70.23,23.56 70.23,17.46 73.18,14.52 73.23,2.69 72.14,1.78 56.68,1.78 56.68,2.12 55.88,2.92 55.88,5.46 54.61,6.41 49.85,6.41 49.85,5.46 47.62,3.24 47.12,2.41 29.84,2.41 29.84,6.41 22.35,6.41 EXT1.RETOURANALOG | EXT6.RETOURANALOG v20.32,62.29 | AT328.23 v66.33,31.08 65.79,30.54 65.79,28.73 RCODE.1
  Bottom 0.406: 67.31,29.91 67.31,29.78 | 67.31,29.78 67.31,25.46 70.23,25.46 v70.23,23.56 | EXT1.RETOURANALOG 22.23,7.18 22.23,9.91 20.32,11.18 EXT2.RETOURANALOG 20.45,17.97 21.84,19.37 21.84,30.42 EXT3.RETOURANALOG 21.46,33.08 21.84,33.44 21.84,41.97 20.32,43.24 EXT4.RETOURANALOG 21.84,44.64 21.84,54.04 20.95,54.67 | EXT5.RETOURANALOG 20.83,54.8 20.95,54.67 | v20.32,62.29 20.32,59.75 21.84,58.48 21.84,55.31 20.95,54.67 | v66.33,31.08 66.33,30.77 67.31,29.78
DTR
  Top 0.406: CRST.1 87.5,30.16 88.39,31.05 88.39,49.85 87.63,50.61 84.58,50.61 83.82,51.37 PROG1.1
GND  (via drill 0.6, 0.6 pad 0.41)
  other vias: 46.35,56.58 48.26,61.66 31.75,64.83 23.5,57.21 2.54,53.4 34.92,34.35 23.5,45.15 87.63,17.21 91.44,13.4 92.08,19.75 82.55,17.84 60.91,8.27 65.48,8.19 70.18,8.06 79.71,31.58 84.68,32.02 32.31,54.37 38.76,54.39 33.97,48.17 37.69,49.42 43.89,47.26 44.02,40.98 12.7,26.73 24.13,19.11 33.02,19.11 58.42,35.62 80.64,13.4 61.59,41.34 62.23,45.15 15.24,61.02 34.29,10.22 24.77,8.64 9.27,47.43 13.65,12.76 14.61,15.94 44.2,56.77 82.87,22.29 10.16,52.77 22.86,72.45 17.78,72.45 19.05,75.63 4.76,78.49 3.17,72.45 65.72,37.53 68.26,37.85 69.53,28.64 75.25,41.02 53.02,78.17 52.7,74.36 61.28,19.43 55.88,20.7 20,25.15 49.21,1.97
  pour Top: -6.03,89.6 107.63,89.6 107.63,-3.75 -6.03,-3.75
  pour Bottom: -8.57,92.46 114.3,92.46 114.3,-14.54 -8.57,-14.54
IN_1
  Top 0.406: U$4.37 49.05,9.59 48.26,8.95 48.26,6.41 47.37,5.52 RIN1.2 46.32,4.55 46.35,4.51 41.78,4.51 IN1.2
IN_2
  Top 0.406: U$4.35 48.9,11.64 48.9,10.86 48.64,10.6 RIN2.2 46.32,8.99 42.55,8.95 IN2.2
IN_3
  Top 0.406: U$4.33 50.14,15.68 RIN3.2 46.32,14.07 42.55,14.03 IN3.2
IN_4
  Top 0.406: U$4.31 50.35,19.11 49.53,19.11 48.9,19.75 48.9,20.38 48.51,20.76 RIN4.2 46.32,19.15 42.55,19.11 IN4.2
MISO  (via drill 0.6, 0.6 pad 0.41)
  Top 0.406: 15.24,8.95 EXT1.MISO 15.24,14.35 v7.3,14.35 | ISP.1 9.53,76.9 v2.86,76.9 3.81,81.34 45.72,81.34 49.21,77.85 49.21,67.37 49.85,66.74 55.24,66.74 58.42,63.56 58.42,53.72 61.28,50.86 61.28,48.64 v71.12,48.64 | EXT3.MISO 15.24,36.26 12.7,38.8 v7.3,38.8 | EXT5.MISO 15.24,58.48 12.06,61.66 v7.3,61.66 | EXT4.MISO 15.24,47.05 12.7,49.59 v7.3,49.59 | EXT2.MISO 15.24,21.65 13.34,24.51 v7.3,24.51 | v15.24,72.45 EXT6.MISO | v70.48,41.66 70.48,37.75 AT328.16
  Bottom 0.406: U$4.21 50.6,30.35 48.26,28 48.26,5.46 45.09,2.29 44.77,2.29 8.26,2.29 7.3,4.19 v7.3,14.35 v7.3,24.51 v7.3,38.8 v7.3,49.59 v7.3,61.66 7.3,69.6 5.71,71.18 5.71,75.63 v2.86,76.9 | ISP.1 10.16,73.41 11.11,72.45 v15.24,72.45 | v71.12,48.64 71.12,42.61 v70.48,41.66
MOSI  (via drill 0.6, 0.6 pad 0.41)
  Top 0.305: 40.64,56.05 v40.66,49.42
  Top 0.406: EXT2.MOSI 12.7,15.94 12.06,15.3 v8.26,15.3 | EXT3.MOSI 12.7,29.91 12.06,29.27 v8.26,29.27 | EXT4.MOSI 12.7,41.34 11.43,40.07 v8.26,40.07 | EXT6.MOSI 12.7,64.2 12.06,63.56 v8.26,63.56 | EXT5.MOSI 12.7,52.45 11.75,51.5 v8.26,51.5 | REG1.14 40.64,56.05 | v22.54,74.68 25.4,73.09 33.97,73.09 TITREUR2.7 | TITREUR1.7 37.47,80.71 45.4,80.71 48.58,77.53 48.58,67.06 49.53,66.1 54.93,66.1 57.78,63.25 57.78,53.4 60.64,50.55 60.64,48.01 69.85,48.01 v72.07,45.78 | v71.75,41.34 71.75,37.47 AT328.15
  Bottom 0.406: 15.56,2.92 44.45,2.92 47.62,6.1 47.62,31.18 49.54,32.59 U$4.19 48.01,36.71 48.01,38.42 46.67,39.43 41.27,39.43 41.27,47.31 v40.66,49.42 | 15.56,2.92 8.89,2.92 8.26,4.19 v8.26,15.3 v8.26,29.27 v8.26,40.07 v8.26,51.5 v8.26,63.56 8.26,69.98 6.73,71.82 6.73,77.53 6.35,78.17 6.35,78.8 8.26,80.71 12.7,80.71 12.7,80.58 | EXT1.MOSI 12.7,4.51 15.56,2.92 | 12.7,80.58 ISP.4 | 12.7,80.58 23.66,80.58 | 23.66,80.58 33.78,80.58 TITREUR1.7 | 23.66,80.58 23.66,80.56 22.54,79.44 v22.54,74.68 | v72.07,45.78 72.07,41.66 v71.75,41.34
N$3
  Top 1.016: RBAT1.1 MOS_BAT.3
N$7
  Top 0.406: REG1.9 33.97,52.96 35.05,51.63 35.05,44.26 35.81,43.5 43.81,43.5 REG2.14
N$11
  Top 0.406: MOS_TEMP.3 62.19,26.56 PTC.2
N$12
  Top 1.016: RAW_IN.1 F1.P$1
N$43
  Top 0.406: AT328.7 78.64,35.08 79.38,34.35 82.55,34.35 83.19,33.72 84.84,33.72 8MHZ.1
N$44
  Top 0.406: AT328.8 79.11,35.88 80.01,34.99 81.92,34.99 81.92,36.89 83.19,38.16 83.57,38.8 8MHZ.3
OUT_1
  Top 0.61: OUT1.1 61.21,6.67 62.23,7.68 62.23,13.12 Q5.2
OUT_2
  Top 0.61: Q7.2 66.82,13.26 67.31,12.76 67.31,7.68 66.99,7.68 66.36,7.05 66.36,5.21 OUT2.1
OUT_3
  Top 0.61: Q8.2 71.79,13.36 72.39,12.76 72.39,8.64 71.44,7.68 71.44,5.21 OUT3.1
OUT_POWER_1
  Top 1.016: MOS_PWR1.2 96.52,43.39 PWR_OUT1.1
OUT_POWER_2
  Top 1.016: MOS_PWR2.2 96.52,30.69 PWR_OUT2.1
OUT_POWER_3
  Top 1.016: MOS_PWR3.2 96.52,17.99 PWR_OUT3.1
RAW  (via drill 0.6, 0.6 pad 0.41)
  Top 1.016: MOS_PWR3.3 MOS_PWR2.3 MOS_PWR1.3 89.53,42.77 89.53,46.67 95.44,52.13 RBAT1.2 95.47,54.42 95.74,54.69 | U$5.IN+ 58.33,50.96 55.56,54.04 55.56,63.88 54.61,64.83 47.94,64.83 47.62,64.52 47.62,63.25 45.72,61.34 45.72,59.75 v29.21,59.75 | EXT5.RAW 17.78,52.64 v27.94,52.64 | EXT6.RAW 17.78,61.02 v22.86,61.02 | EXT4.RAW 17.78,40.7 v27.94,40.7 | EXT3.RAW 17.78,29.53 v27.94,29.53 | EXT2.RAW 17.78,15.81 v27.94,15.81 | 95.74,54.69 F1.P$2 | C2.A 93.73,56.71 v95.47,54.97 95.74,54.69
  Bottom 1.016: v22.86,61.02 27.94,61.02 v29.21,59.75 29.21,57.21 27.94,55.94 v27.94,52.64 v27.94,40.7 v27.94,29.53 v27.94,15.81 27.94,4.83 17.78,4.83 EXT1.RAW | U$5.IN+ 62.68,58.61 88.52,58.61 93.34,58.67 94.19,57.32 v95.47,54.97
REG_CLR  (via drill 0.6)
  Top 0.305: 39.67,57.47 39.67,52.9 39.37,52.64 39.37,49.85
  Top 0.406: REG2.10 v38.12,46.7 | v48.77,49.34 48.77,42.98 U$4.13 | REG1.10 35.24,57.4 35.31,57.47 39.67,57.47 | v39.24,49.44 39.37,49.85
  Bottom 0.406: v38.12,46.7 38.73,48.7 v39.24,49.44 40.13,50.61 47.75,50.61 v48.77,49.34
REG_RCK  (via drill 0.6)
  Top 0.406: REG1.12 37.78,53.59 36.58,52.39 36.6,48.55 v42.82,48.48 41.27,46.8 REG2.12 41.4,45
  Bottom 0.406: v42.82,48.48 45.72,48.45 46.23,47.43 46.23,44.26 46.48,44.01 50.45,44.01 U$4.11
RESET  (via drill 0.6)
  Top 0.406: v74.68,26.73 74.68,26.99 | 74.68,26.99 74.04,27.62 74.04,28.77 AT328.29 | 74.68,26.99 80.39,26.99 81.92,25.46 85.72,25.46 85.72,26.69 RRST.1
  Top 0.61: CRST.2 83.89,29.04 RRST.1
  Bottom 0.406: ISP.5 15.24,73.72 48.9,73.72 48.9,65.47 54.61,65.47 55.88,63.88 56.83,62.61 57.15,61.02 57.15,47.05 64.14,42.23 64.14,40.7 64.77,40.07 64.77,36.26 67.94,36.26 67.94,28 69.22,26.73 v74.68,26.73
RST1  (via drill 0.6)
  Top 0.406: TITREUR1.1 45.72,78.8 47.24,77.28 47.62,77.28 47.62,66.87 47.18,66.29 45.47,64.26 45.34,63.94 v45.34,62.74 | v42.24,54.39 41.66,55.98 REG1.15
  Bottom 0.406: v45.34,62.74 45.34,54.37 v42.24,54.39
RST2
  Top 0.406: REG1.1 42.86,63.88 43.5,64.83 45.09,64.83 46.99,67.06 46.99,76.26 46.04,77.22 44.45,77.22 43.5,76.26 TITREUR1.2
RST3  (via drill 0.6)
  Top 0.406: REG1.2 41.59,63.25 42.86,65.47 44.77,65.47 46.35,67.37 46.35,74.87 v45.47,75.76
  Bottom 0.406: v45.47,75.76 45.09,76.58 44.45,77.53 41.91,77.53 TITREUR1.3
RST4
  Top 0.406: REG1.3 40.32,63.25 42.55,66.1 44.45,66.1 45.72,67.69 45.72,73.41 45.09,74.36 40.64,74.36 TITREUR1.4
RST5
  Top 0.406: REG1.4 39.05,63.25 42.23,66.74 44.13,66.74 45.09,68.01 45.09,73.09 43.81,73.09 43.18,72.45 TITREUR2.1
RST6
  Top 0.406: REG1.5 37.78,63.25 41.91,67.37 43.18,67.37 TITREUR2.2
RST7
  Top 0.406: REG1.6 36.51,63.88 39.37,66.74 39.37,69.91 TITREUR2.3
RST8  (via drill 0.6)
  Top 0.406: REG1.7 35.24,64.52 v37.47,66.74
  Bottom 0.406: v37.47,66.74 40.01,66.74 40.64,67.37 TITREUR2.4
RX-I  (via drill 0.6)
  Top 0.406: AT328.30 74.86,30.23 v72.58,30.29 | v77.72,39.43 80.01,39.43 80.01,59.63 PROG1.3
  Bottom 0.406: v72.58,30.29 72.58,35.56 v77.72,39.43
RXA+
  Top 0.406: U$4.10 53.74,46.14 55.12,44.77 55.12,41.85 56.26,40.7 A+_UART.2
SCK  (via drill 0.6, 0.6 pad 0.41)
  Top 0.406: EXT2.SCK 12.7,22.29 11.43,23.24 v6.35,23.24 | EXT1.SCK 12.7,11.18 11.43,12.76 v6.35,12.76 | v6.35,68.96 6.35,71.18 8.89,74.36 12.7,74.36 | ISP.3 12.7,74.36 | 12.7,74.36 EXT6.SCK | EXT3.SCK 12.7,34.99 10.79,36.89 v6.35,36.89 | EXT5.SCK 12.7,57.85 10.16,60.39 v6.35,60.39 | EXT4.SCK 12.7,46.42 10.79,48.39 v6.35,48.39 | REG1.11 36.51,53.34 35.81,52.64 35.81,47.69 v39.7,47.59 40.01,46.8 REG2.11 40.13,45 40.13,45.02 | v39.88,42.48 46.99,42.48 48.01,41.47 48.01,31.45 U$4.23 | 12.7,74.36 17.34,74.36 17.34,77.53 36.83,77.53 | 36.83,77.53 TITREUR1.5 | 36.83,77.53 36.83,72.45 TITREUR2.5 | v59.69,55.94 59.69,53.4 61.91,51.18 61.91,49.28 62.87,49.28 v63.82,49.91 | v69.53,40.7 69.53,36.05 AT328.17
  Bottom 0.406: U$4.23 50.13,28.6 48.9,27.37 48.9,4.83 45.72,1.65 7.62,1.65 6.35,4.51 v6.35,12.76 v6.35,23.24 v6.35,36.89 v6.35,48.39 v6.35,60.39 v6.35,68.96 | v39.7,47.59 v39.88,42.48 | TITREUR1.5 38.1,80.07 38.73,80.71 46.35,80.71 49.85,77.22 49.85,67.69 50.16,67.37 55.56,67.37 59.05,63.88 59.05,56.58 v59.69,55.94 | v63.82,49.91 63.82,44.2 66.36,41.66 69.53,41.66 v69.53,40.7
TX-O  (via drill 0.6)
  Top 0.406: AT328.31 75.66,31.21 v73.79,31.24 | v77.72,37.91 81.03,37.91 81.03,60.9 PROG1.2
  Bottom 0.406: v73.79,31.24 73.79,35.24 v77.72,37.91
TXA+
  Top 0.406: 53.4,48.39 U$4.8 55.12,46.88 55.12,45.78 57.15,43.5 A+_UART.1
VCC
  Top 0.406: REG1.16 43.62,55.5 43.69,52.9 46.74,52.9 47.5,52.13 47.5,46.55 46.35,46.55 REG2.16

### Text on the board
tNames: KXKM - DNC / Carte proto titreur / v 0.1 / / Réalisation : / Pierre Hoezelle / Olivier Radisson
bNames: KXKM - DNC / Carte proto titreur / v 0.1 / / Réalisation : / Pierre Hoezelle / Olivier Radisson